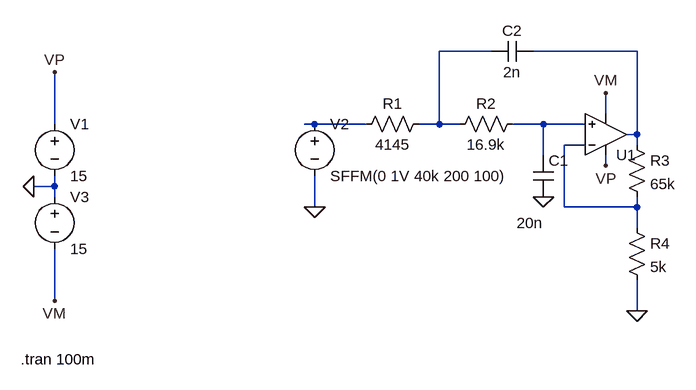
[diagram p0: schematic Draft8.asc]
Draft8.asc, the LTspice schematic file:
Version 4
SHEET 1 968 680
WIRE 240 -64 160 -64
WIRE 464 -64 304 -64
WIRE 416 32 416 0
WIRE -432 48 -432 -32
WIRE -32 48 -48 48
WIRE 48 48 -32 48
WIRE 160 48 160 -64
WIRE 160 48 128 48
WIRE 192 48 160 48
WIRE 320 48 272 48
WIRE 384 48 320 48
WIRE 464 64 464 -64
WIRE 464 64 448 64
WIRE 384 80 352 80
WIRE 464 80 464 64
WIRE 320 96 320 48
WIRE 416 112 416 96
WIRE -432 144 -432 128
WIRE -432 144 -464 144
WIRE -432 160 -432 144
WIRE -32 176 -32 128
WIRE 352 176 352 80
WIRE 464 176 464 160
WIRE 464 176 352 176
WIRE 464 208 464 176
WIRE -432 320 -432 240
WIRE 464 336 464 288
FLAG -32 176 0
FLAG -464 144 0
FLAG 320 160 0
FLAG -432 -32 VP
FLAG -432 320 VM
FLAG 416 112 VP
FLAG 416 0 VM
FLAG 464 336 0
SYMBOL Opamps\\UniversalOpamp2 416 64 M180
SYMATTR InstName U1
SYMATTR SpiceModel level.1
SYMBOL voltage -432 32 R0
WINDOW 123 0 0 Left 0
WINDOW 39 0 0 Left 0
SYMATTR InstName V1
SYMATTR Value 15
SYMBOL voltage -432 144 R0
WINDOW 123 0 0 Left 0
WINDOW 39 0 0 Left 0
SYMATTR InstName V3
SYMATTR Value 15
SYMBOL res 144 32 R90
WINDOW 0 0 56 VBottom 0
WINDOW 3 32 56 VTop 0
SYMATTR InstName R1
SYMATTR Value 4145
SYMBOL res 288 32 R90
WINDOW 0 0 56 VBottom 0
WINDOW 3 32 56 VTop 0
SYMATTR InstName R2
SYMATTR Value 16.9k
SYMBOL cap 304 96 R0
WINDOW 3 -25 104 Left 0
SYMATTR Value 20n
SYMATTR InstName C1
SYMBOL cap 304 -80 R90
WINDOW 0 0 32 VBottom 0
WINDOW 3 32 32 VTop 0
SYMATTR InstName C2
SYMATTR Value 2n
SYMBOL res 448 64 R0
SYMATTR InstName R3
SYMATTR Value 65k
SYMBOL res 448 192 R0
SYMATTR InstName R4
SYMATTR Value 5k
SYMBOL voltage -32 32 R0
WINDOW 123 0 0 Left 0
WINDOW 39 0 0 Left 0
SYMATTR InstName V2
SYMATTR Value SFFM(0 1V 40k 200 100)
TEXT -484 410 Left 0 !.tran 100m

The netlist it stands for:
* Draft8.asc
XU1 N004 N005 VP VM N002 level.1 Avol=1Meg GBW=10Meg Slew=10Meg ilimit=25m rail=0 Vos=0 phimargin=45 en=0 enk=0 in=0 ink=0 Rin=500Meg  ; pins IN+ IN- V+ V- OUT
V1 VP 0 15
V3 0 VM 15
R1 N001 N003 4145
R2 N004 N001 16.9k
C1 N004 0 20n
C2 N002 N001 2n
R3 N002 N005 65k
R4 N005 0 5k
V2 N003 0 SFFM(0 1V 40k 200 100)
.tran 100m
.lib UniversalOpamps2.sub
.backanno
.end